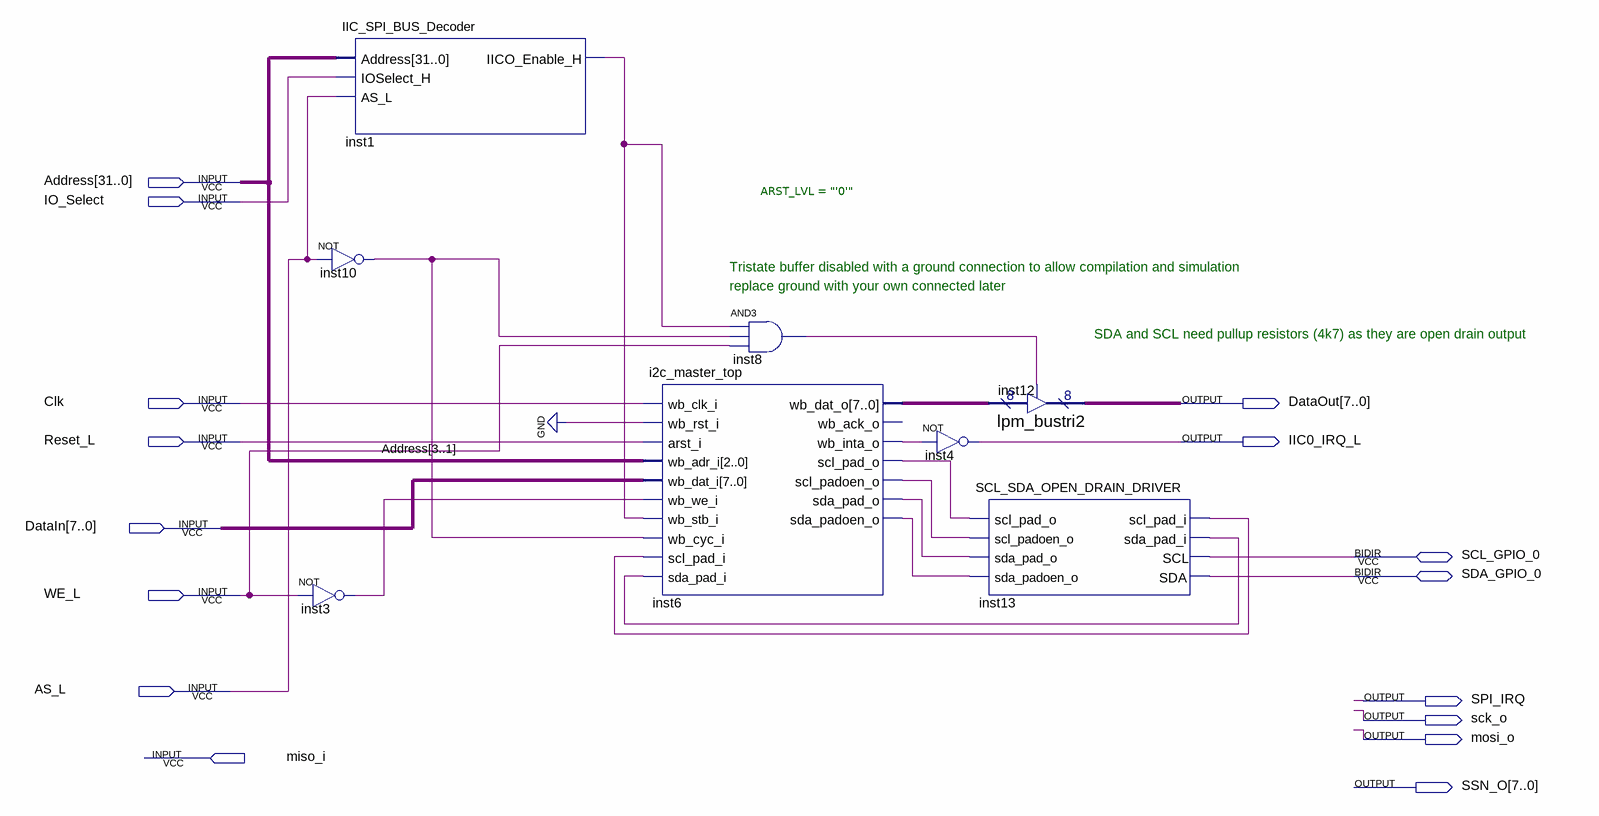
[diagram p0: schematic sheet]
// Quartus schematic IIC_SPI_Interface.bdf as structural Verilog: 8 symbols, 16 pins
module IIC_SPI_Interface (
  input  [31:0] Address,
  input  IO_Select,
  input  Clk,
  input  Reset_L,
  input  [7:0] DataIn,
  input  WE_L,
  input  AS_L,
  input  miso_i,
  inout  SCL_GPIO_0,
  inout  SDA_GPIO_0,
  output [7:0] DataOut,
  output IIC0_IRQ_L,
  output SPI_IRQ,
  output sck_o,
  output mosi_o,
  output [7:0] SSN_O
);

  wire inst1_iico_enable_h, inst3_out, inst6_scl_pad_o, inst6_scl_padoen_o, inst6_sda_pad_o,
       inst6_sda_padoen_o, inst6_wb_inta_o, inst8_out, inst10_out, inst13_scl_pad_i, inst13_sda_pad_i;
  wire [7:0] inst6_wb_dat_o;

  IIC_SPI_BUS_Decoder inst1 (
    .Address(Address), .IOSelect_H(IO_Select), .AS_L(AS_L), .IICO_Enable_H(inst1_iico_enable_h));
  not inst10 (inst10_out, AS_L);
  not inst3 (inst3_out, WE_L);
  i2c_master_top #(.ARST_LVL("'0'")) inst6 (
    .wb_clk_i(Clk), .wb_rst_i(1'b0), .arst_i(Reset_L), .wb_adr_i(Address[3:1]), .wb_dat_i(DataIn),
    .wb_we_i(inst3_out), .wb_stb_i(inst1_iico_enable_h), .wb_cyc_i(inst10_out), .scl_pad_i(inst13_scl_pad_i),
    .sda_pad_i(inst13_sda_pad_i), .wb_dat_o(inst6_wb_dat_o), .wb_inta_o(inst6_wb_inta_o),
    .scl_pad_o(inst6_scl_pad_o), .scl_padoen_o(inst6_scl_padoen_o), .sda_pad_o(inst6_sda_pad_o),
    .sda_padoen_o(inst6_sda_padoen_o));  // open: wb_ack_o
  and inst8 (inst8_out, inst1_iico_enable_h, inst10_out, WE_L);
  not inst4 (IIC0_IRQ_L, inst6_wb_inta_o);
  lpm_bustri2 inst12 (.enabledt(inst8_out), .data(inst6_wb_dat_o), .tridata(DataOut));
  SCL_SDA_OPEN_DRAIN_DRIVER inst13 (
    .scl_pad_o(inst6_scl_pad_o), .scl_padoen_o(inst6_scl_padoen_o), .sda_pad_o(inst6_sda_pad_o),
    .sda_padoen_o(inst6_sda_padoen_o), .scl_pad_i(inst13_scl_pad_i), .sda_pad_i(inst13_sda_pad_i),
    .SCL(SCL_GPIO_0), .SDA(SDA_GPIO_0));

  // Notes on the sheet:
  //   Tristate buffer disabled with a ground connection to allow compilation and simulation
  //   replace ground with your own connected later
  //   SDA and SCL need pullup resistors (4k7) as they are open drain output
endmodule
